# Altium project magcontrolv1.PRJPCB
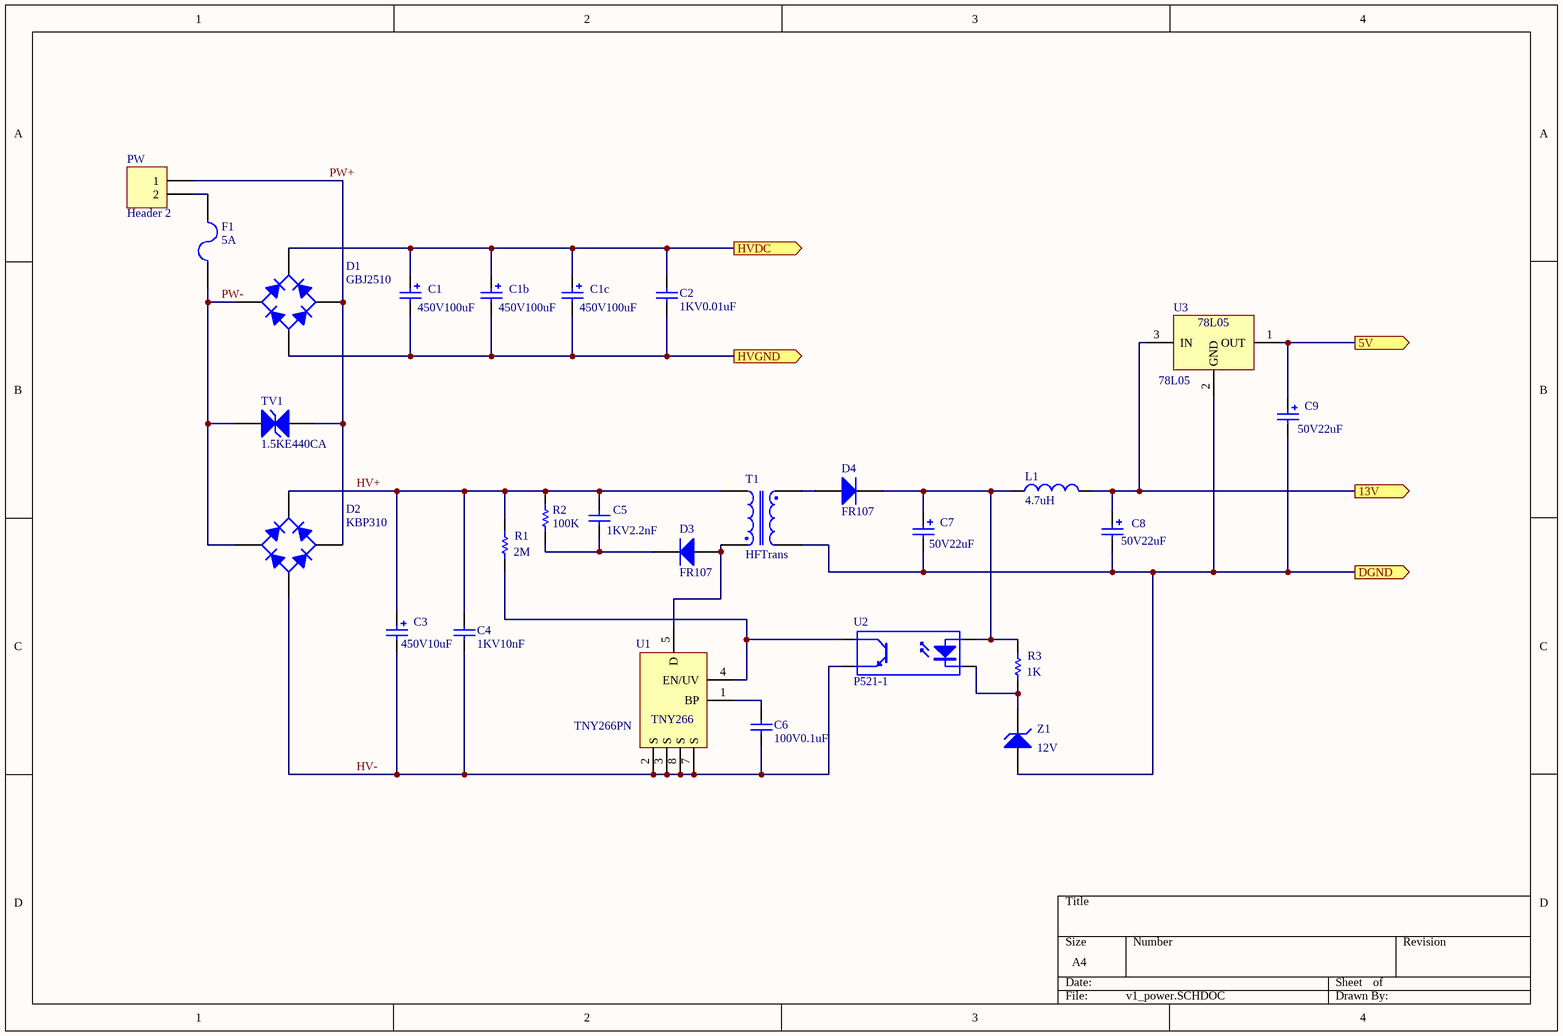
[diagram p0: v1_power.SCHDOC]
2 sheets, 55 parts. Net scope: flat (ports and power ports of the same name join across sheets).
Board file: v1_pcb.PCBDOC
Sheets:
  v1_power.SCHDOC
  v1_control.SCHDOC

## Sheet v1_power.SCHDOC
size A4

### Parts
C1  450V100uF  [CAP_18x30]
C1b  450V100uF  [CAP_18x30]
C1c  450V100uF  [CAP_10mm_stub]
C2  1KV0.01uF  [CAP7]
C3  450V10uF  [CAP2]
C4  1KV10nF  [CAP7]
C5  1KV2.2nF  [CAP5]
C6  100V0.1uF  [CAP6]
C7  50V22uF  [CAP3]
C8  50V22uF  [CAP3]
C9  50V22uF  [CAP3]
D1  GBJ2510  [GBJ2510]
D2  KBP310  [KBP310]
D3  FR107  [DIO1]
D4  FR107  [DIO1]
F1  5A  [FUSE]
L1  4.7uH  [INDUCTOR]
PW  Header 2  [Terminal2_1]
R1  2M  [RES0.25W]
R2  100K  [RES0.25W]
R3  1K  [RES0.25W]
T1  HFTrans  [EE16]
TV1  1.5KE440CA  [TVS1]
U1  TNY266PN  [TNY266PN]
U2  P521-1  [DIP-4]
U3  78L05  [TO-92D]
Z1  12V  [DIO2]

### Ports
5V, 13V, DGND, HVDC, HVGND

### Nets
5V: C9.1 U3.1(OUT) ; port 5V
13V: C8.1 L1.2 U3.3(IN) ; port 13V
GND: C1.2 C1b.2 C1c.2 C2.2 C7.2 C8.2 C9.2 D1.4(A) T1.5 U3.2(GND) Z1.1(A) ; port HVGND, port DGND
HVDC: C1.1 C1b.1 C1c.1 C2.1 D1.1(K) ; port HVDC
HV+: C3.1 C4.1 C5.2 D2.1(K) R1.2 R2.2 T1.1
HV-: C3.2 C4.2 C6.1 D2.4(A) U1.2(S) U1.3(S) U1.7(S) U1.8(S) U2.3(E)
PW+: D1.2(C) D2.2(C) PW.1 TV1.2(K)
PW-: D1.3(C) D2.3(C) F1.2 TV1.1(A)
NetC5_1: C5.1 D3.2(K) R2.1
NetC6_2: C6.2 U1.1(BP)
NetC7_1: C7.1 D4.2(K) L1.1 R3.2 U2.1(A)
NetD3_1: D3.1(A) T1.4 U1.5(D)
NetD4_1: D4.1(A) T1.8
NetF1_1: F1.1 PW.2
NetR1_1: R1.1 U1.4(EN/UV) U2.4(C)
NetR3_1: R3.1 U2.2(K) Z1.2(K)

### Notes on the sheet
- (in symbol TNY266PN) TNY266

### Library data of the parts
C1 C1b C1c C3 C7-C9 = Cap Pol2: Polarized Capacitor (Axial); Published: 8-Jun-2000; LatestRevisionDate: 17-Jul-2002; LatestRevisionNote: Re-released for DXP Platform.; Publisher: Altium Limited
C2 C4-C6 = Cap: Capacitor; Published: 8-Jun-2000; LatestRevisionDate: 17-Jul-2002; LatestRevisionNote: Re-released for DXP Platform.; Publisher: Altium Limited
D1 = GBJ2510: Single Phase Rectifier Bridge; Published: 8-Jun-2000; LatestRevisionDate: 17-Jul-2002; LatestRevisionNote: Re-released for DXP Platform.; DatasheetDocument: E2753A; PackageReference: D-44; Publisher: Altium Limited; ComponentLink1Description: Manufacturer Link; ComponentLink1URL: http://www.irf.com/
D2 = KBP310: Single Phase Rectifier Bridge; Published: 8-Jun-2000; LatestRevisionDate: 17-Jul-2002; LatestRevisionNote: Re-released for DXP Platform.; DatasheetDocument: E2753A; PackageReference: D-44; Publisher: Altium Limited; ComponentLink1Description: Manufacturer Link; ComponentLink1URL: http://www.irf.com/
D3 D4 = Diode: 1 Amp Fast Recovery Rectifier; Published: 8-Jun-2000; LatestRevisionDate: 17-Jul-2002; LatestRevisionNote: Re-released for DXP Platform.; PackageReference: DO-41; Publisher: Altium Limited; Code_JEDEC: DO-204-AL; DatasheetDocument: 1999; PackageDocument: Aug-1999; ComponentLink1Description: Manufacturer Link; ComponentLink1URL: http://www.fairchildsemi.com/
F1 = Fuse 2: Fuse; Published: 8-Jun-2000; LatestRevisionDate: 17-Jul-2002; LatestRevisionNote: Re-released for DXP Platform.; Publisher: Altium Limited
L1 = Inductor: Code_IEC: 1005; Published: 8-Jun-2000; LatestRevisionDate: 17-Jul-2002; LatestRevisionNote: Re-released for DXP Platform.; PackageReference: 0402-A; Publisher: Altium Limited; Code_JEITA: 0402
PW = Header 2: Header, 2-Pin; LatestRevisionDate: 17-Jul-2002; LatestRevisionNote: Re-released for DXP Platform.; Publisher: Altium Limited
R1-R3 = Res1: Resistor; Published: 8-Jun-2000; LatestRevisionDate: 17-Jul-2002; LatestRevisionNote: Re-released for DXP Platform.; Publisher: Altium Limited
T1 = HFTrans: Transformer; Published: 24-Mar-1999; LatestRevisionDate: 17-Jul-2002; LatestRevisionNote: Re-released for DXP Platform.; Publisher: Altium Limited
TV1 = TVS: TVS Diode; Published: 8-Jun-2000; LatestRevisionDate: 17-Jul-2002; LatestRevisionNote: Re-released for DXP Platform.; Publisher: Altium Limited
U1 = TNY266PN: PI TinySwitch II
U2 = Optoisolator1: 4-Pin Phototransistor Optocoupler; Published: 24-Mar-1999; LatestRevisionDate: 4-Mar-2005; LatestRevisionNote: Sch pins 3 & 4 Swapped.; DatasheetDocument: Nov-2003; PackageReference: DIP-4; Publisher: Altium Limited
U3 = 78L05: Positive Voltage Regulator; Published: 24-Aug-2001; LatestRevisionDate: 6-Jun-2005; LatestRevisionNote: PCB pads lengthened.; DatasheetDocument: Apr-1994; PackageDocument: Jun-2004; PackageReference: TO-252; Publisher: Altium Limited; ComponentLink1Description: Manufacturer Link; ComponentLink1URL: http://www.st.com/
Z1 = D Zener: Zener Diode; Published: 8-Jun-2000; LatestRevisionDate: 17-Jul-2002; LatestRevisionNote: Re-released for DXP Platform.; Publisher: Altium Limited

## Sheet v1_control.SCHDOC
size A4
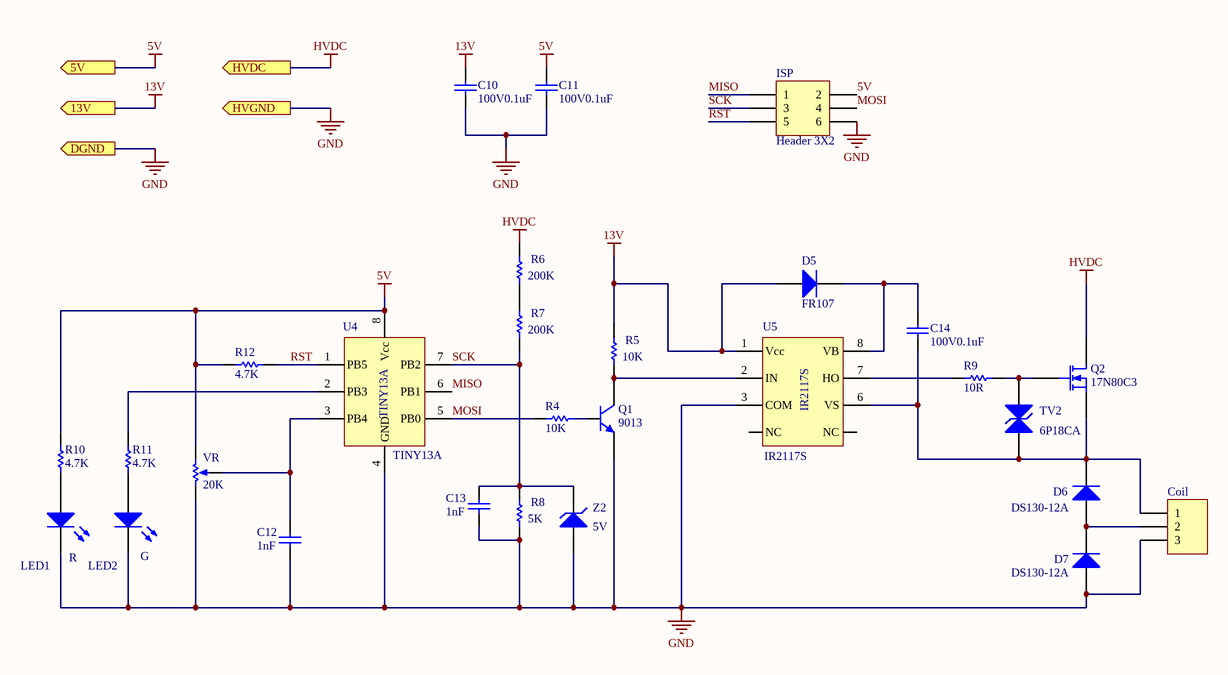
[diagram p1: v1_control.SCHDOC]

### Parts
C10  100V0.1uF  [CAP6]
C11  100V0.1uF  [CAP6]
C12  1nF  [CAP6]
C13  1nF  [CAP6]
C14  100V0.1uF  [CAP6]
Coil  Header 3  [Terminal3_1]  (value not drawn)
D5  FR107  [DIO1]
D6  DS130-12A  [TO-220_2]
D7  DS130-12A  [TO-220_2]
ISP  Header 3X2  [HDR2X3]
LED1  R  [LED1R]
LED2  G  [LED1G]
Q1  9013  [TO-92D]
Q2  17N80C3  [TO-247]
R4  10K  [RES0.25W]
R5  10K  [RES0.25W]
R6  200K  [RES0.25W]
R7  200K  [RES0.25W]
R8  5K  [RES0.25W]
R9  10R  [RES0.25W]
R10  4.7K  [RES0.25W]
R11  4.7K  [RES0.25W]
R12  4.7K  [RES0.25W]
TV2  6P18CA  [TVS2]
U4  TINY13A  [DIP-8]
U5  IR2117S  [DIP-8]
VR  value 20K  [3296W]  (hidden comment: RPot)
Z2  5V  [DIO2]

### Ports
5V, 13V, DGND, HVDC, HVGND

### Nets
5V: C11.1 ISP.2 R10.1 R12.1 U4.8(Vcc) VR.1 ; port 5V
13V: C10.1 D5.1(A) R5.1 U5.1(Vcc) ; port 13V
GND: C10.2 C11.2 C12.2 C13.2 Coil.3 D7.1(A) ISP.6 LED1.2(K) LED2.2(K) Q1.1(E) R8.2 U4.4(GND) U5.3(COM) VR.3 Z2.1(A) ; port HVGND, port DGND
HVDC: Q2.2(D) R6.1 ; port HVDC
MISO: ISP.1 U4.6(PB1)
MOSI: ISP.4 R4.2 U4.5(PB0)
RST: ISP.5 R12.2 U4.1(PB5)
SCK: C13.1 ISP.3 R7.2 R8.1 U4.7(PB2) Z2.2(K)
NetC12_1: C12.1 U4.3(PB4) VR.2
NetC14_1: C14.1 D5.2(K) U5.8(VB)
NetC14_2: C14.2 Coil.1 D6.2(K) Q2.3(S) TV2.1(A) U5.6(VS)
NetCoil_2: Coil.2 D6.1(A) D7.2(K)
NetLED1_1: LED1.1(A) R10.2
NetLED2_1: LED2.1(A) R11.2
NetQ1_2: Q1.2(B) R4.1
NetQ1_3: Q1.3(C) R5.2 U5.2(IN)
NetQ2_1: Q2.1(G) R9.2 TV2.2(K)
NetR6_2: R6.2 R7.1
NetR9_1: R9.1 U5.7(HO)
NetR11_1: R11.1 U4.2(PB3)

Not connected (* = marked no-connect by the designer): U5 4(NC) 5(NC)

### Library data of the parts
C10-C14 = Cap: Capacitor; Published: 8-Jun-2000; LatestRevisionDate: 17-Jul-2002; LatestRevisionNote: Re-released for DXP Platform.; Publisher: Altium Limited
Coil = Header 3: Header, 3-Pin; LatestRevisionDate: 17-Jul-2002; LatestRevisionNote: Re-released for DXP Platform.; Publisher: Altium Limited
D5 = Diode: 1 Amp Fast Recovery Rectifier; Published: 8-Jun-2000; LatestRevisionDate: 17-Jul-2002; LatestRevisionNote: Re-released for DXP Platform.; PackageReference: DO-41; Publisher: Altium Limited; Code_JEDEC: DO-204-AL; DatasheetDocument: 1999; PackageDocument: Aug-1999; ComponentLink1Description: Manufacturer Link; ComponentLink1URL: http://www.fairchildsemi.com/
D6 D7 = Diode: Published: 8-Jun-2000; LatestRevisionDate: 17-Jul-2002; LatestRevisionNote: Re-released for DXP Platform.; DatasheetDocument: 1999; PackageDocument: Aug-1999; PackageReference: DO-41; Publisher: Altium Limited; ComponentLink1Description: Manufacturer Link; ComponentLink1URL: http://www.fairchildsemi.com/; Code_JEDEC: DO-204-AL
ISP = Header 3X2: Header, 3-Pin, Dual row; LatestRevisionDate: 17-Jul-2002; LatestRevisionNote: Re-released for DXP Platform.; Publisher: Altium Limited
LED1 LED2 = LED: Published: 8-Jun-2000; LatestRevisionDate: 08-Jul-2005; LatestRevisionNote: Mech Layer 1 removed.; PackageReference: LED-0; Publisher: Altium Limited; PackageDescription: LED; 2 Leads
Q1 = 9013: NPN Bipolar Transistor; Published: 8-Jun-2000; LatestRevisionDate: 17-Jul-2002; LatestRevisionNote: Re-released for DXP Platform.; PackageReference: TO-226-AA; Publisher: Altium Limited; PackageDescription: TO, Flat Index; 3 In-Line, Axial Leads; Body Dia. 4.8mm; Leads 0.55 x 0.51 mm (max); Code_JEDEC: TO-226-AA
Q2 = 17N80C3: MOSFET N; Published: 8-Jun-2000; LatestRevisionDate: 17-Jul-2002; LatestRevisionNote: Re-released for DXP Platform.; PackageVersion: 1995/1996; PackageReference: E3; Publisher: Altium Limited; PackageDescription: TO, Flat Index; 3 In-Line, Axial Leads; Body Dia. 4.6mm; Lead Dia. 0.5 mm (max)
R4-R12 = Res1: Resistor; Published: 8-Jun-2000; LatestRevisionDate: 17-Jul-2002; LatestRevisionNote: Re-released for DXP Platform.; Publisher: Altium Limited
TV2 = TVS: TVS Diode; Published: 8-Jun-2000; LatestRevisionDate: 17-Jul-2002; LatestRevisionNote: Re-released for DXP Platform.; Publisher: Altium Limited
U4 = TINY13A: AVR MCU
U5 = IR2117S: MOSFET Driver
VR = RPot: Potentiometer; Sim Note: Enter the Resistance value and the set point into parameter fields.; Set Position: 0.5; Published: 8-Jun-2000; LatestRevisionDate: 17-Jul-2002; LatestRevisionNote: Re-released for DXP Platform.; PackageReference: VR5; Publisher: Altium Limited; PackageDescription: Variable Resistor, Thru-Hole; 3 Leads
Z2 = D Zener: Zener Diode; Published: 8-Jun-2000; LatestRevisionDate: 17-Jul-2002; LatestRevisionNote: Re-released for DXP Platform.; Publisher: Altium Limited

## Nets that join several sheets
5V: v1_power (C9.1 U3.1), v1_control (6 pins)
13V: v1_power (C8.1 L1.2 U3.3), v1_control (C10.1 D5.1 R5.1 U5.1)
GND: v1_power (11 pins), v1_control (15 pins)
HVDC: v1_power (5 pins), v1_control (Q2.2 R6.1)